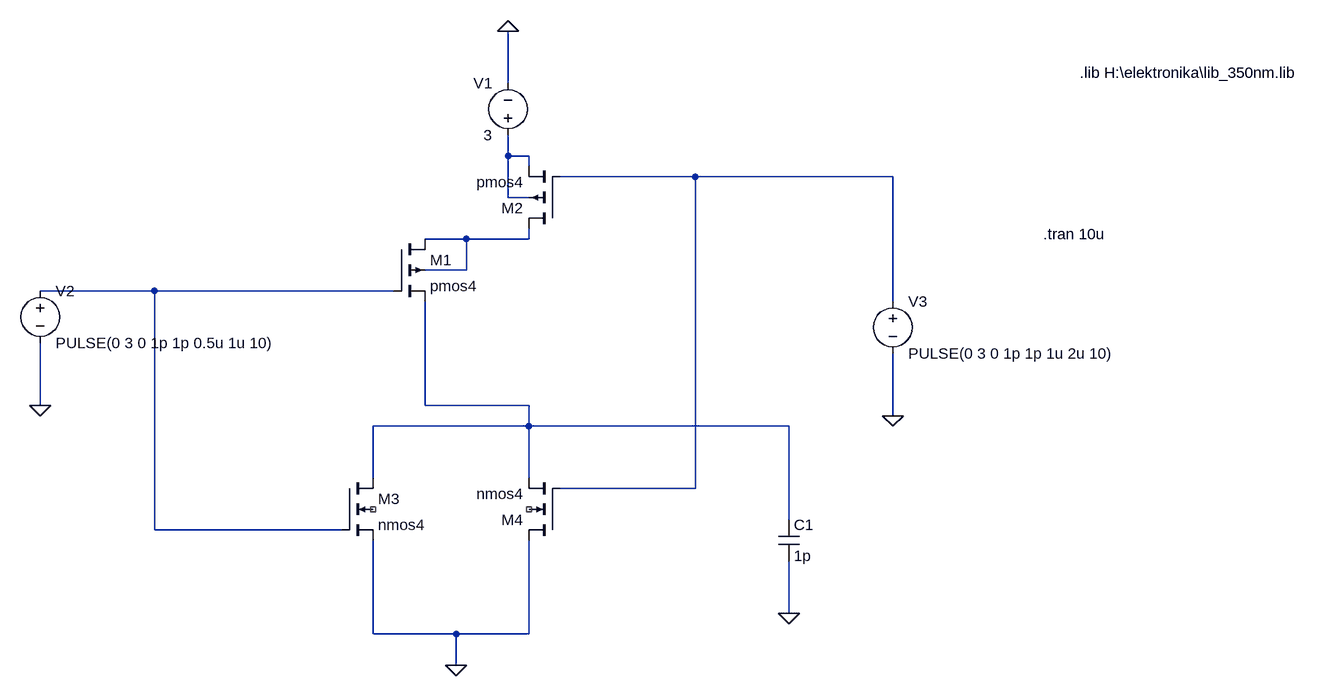
[diagram p0: schematic nor.asc]
nor.asc, the LTspice schematic file:
Version 4
SHEET 1 1208 680
WIRE -80 -320 -80 -400
WIRE -80 -208 -80 -240
WIRE -48 -208 -80 -208
WIRE -48 -192 -48 -208
WIRE 208 -176 0 -176
WIRE 512 -176 208 -176
WIRE -80 -144 -80 -208
WIRE -48 -144 -80 -144
WIRE -144 -80 -208 -80
WIRE -48 -80 -48 -96
WIRE -48 -80 -144 -80
WIRE -144 -32 -144 -80
WIRE -144 -32 -208 -32
WIRE -624 0 -800 0
WIRE -256 0 -624 0
WIRE 512 16 512 -176
WIRE -800 176 -800 80
WIRE -208 176 -208 16
WIRE -48 176 -208 176
WIRE 512 192 512 96
WIRE -48 208 -48 176
WIRE -48 208 -288 208
WIRE 352 208 -48 208
WIRE -288 288 -288 208
WIRE -48 288 -48 208
WIRE 208 304 208 -176
WIRE 208 304 0 304
WIRE 352 352 352 208
WIRE -624 368 -624 0
WIRE -336 368 -624 368
WIRE 352 496 352 416
WIRE -288 528 -288 384
WIRE -160 528 -288 528
WIRE -48 528 -48 384
WIRE -48 528 -160 528
WIRE -160 576 -160 528
FLAG -800 176 0
FLAG 512 192 0
FLAG -80 -400 0
FLAG -160 576 0
FLAG 352 496 0
SYMBOL voltage -80 -224 R180
WINDOW 0 24 96 Left 2
WINDOW 3 24 16 Left 2
WINDOW 123 0 0 Left 2
WINDOW 39 0 0 Left 2
SYMATTR InstName V1
SYMATTR Value 3
SYMBOL voltage -800 -16 R0
WINDOW 123 0 0 Left 2
WINDOW 39 0 0 Left 2
SYMATTR InstName V2
SYMATTR Value PULSE(0 3 0 1p 1p 0.5u 1u 10)
SYMBOL voltage 512 0 R0
WINDOW 123 0 0 Left 2
WINDOW 39 0 0 Left 2
SYMATTR InstName V3
SYMATTR Value PULSE(0 3 0 1p 1p 1u 2u 10)
SYMBOL pmos4 -256 -80 R0
SYMATTR InstName M1
SYMATTR Value pmos4
SYMATTR Value2 l=0.5u w=300u
SYMBOL pmos4 0 -96 R180
SYMATTR InstName M2
SYMATTR Value pmos4
SYMATTR Value2 l=0.5u w=300u
SYMBOL nmos4 -336 288 R0
SYMATTR InstName M3
SYMATTR Value nmos4
SYMATTR Value2 l=0.5u w=50u
SYMBOL nmos4 0 384 R180
SYMATTR InstName M4
SYMATTR Value nmos4
SYMATTR Value2 l=0.5u w=50u
SYMBOL cap 336 352 R0
SYMATTR InstName C1
SYMATTR Value 1p
TEXT 800 -336 Left 2 !.lib H:\\elektronika\\lib_350nm.lib
TEXT 744 -88 Left 2 !.tran 10u

The netlist it stands for:
* nor.asc
V1 N001 0 3
V2 N004 0 PULSE(0 3 0 1p 1p 0.5u 1u 10)
V3 N002 0 PULSE(0 3 0 1p 1p 1u 2u 10)
M1 N003 N004 N005 N003 pmos4 l=0.5u w=300u
M2 N003 N002 N001 N001 pmos4 l=0.5u w=300u
M3 N005 N004 0 NC_01 nmos4 l=0.5u w=50u
M4 0 N002 N005 NC_02 nmos4 l=0.5u w=50u
C1 N005 0 1p
.model NMOS NMOS
.model PMOS PMOS
.lib standard.mos
.lib H:\elektronika\lib_350nm.lib
.tran 10u
.backanno
.end